# EAGLE schematic CAT Box (EAGLE 9.6.2)
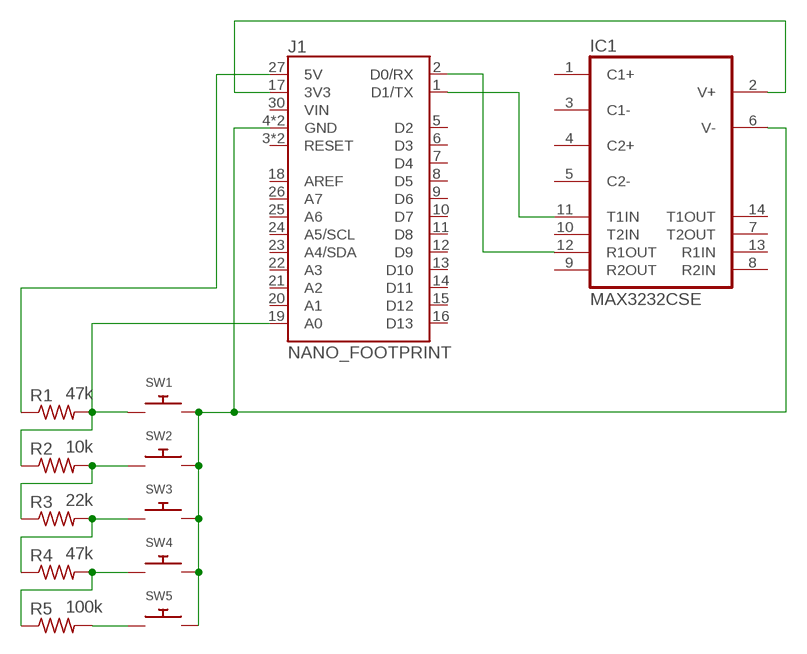
[diagram p0: schematic, sheet 1]

## Parts
IC1  MAX3232CSE  [SO16]
J1  NANO_FOOTPRINT  [NANO]
R1  47k  R-US_0207/10  [0207/10]
R2  10k  R-US_0207/10  [0207/10]
R3  22k  R-US_0207/10  [0207/10]
R4  47k  R-US_0207/10  [0207/10]
R5  100k  R-US_0207/10  [0207/10]
SW1  SWITCH_PUSHBUTTONEVQ-PE  [TACT_PANA-EVQ]
SW2  SWITCH_PUSHBUTTONEVQ-PE  [TACT_PANA-EVQ]
SW3  SWITCH_PUSHBUTTONEVQ-PE  [TACT_PANA-EVQ]
SW4  SWITCH_PUSHBUTTONEVQ-PE  [TACT_PANA-EVQ]
SW5  SWITCH_PUSHBUTTONEVQ-PE  [TACT_PANA-EVQ]

## Nets
N$1: J1.19(A0) R1.2 R2.1 SW1.P$1
N$2: IC1.12(R1OUT) J1.2(D0/RX)
N$3: R2.2 R3.1 SW2.P$1
N$4: R3.2 R4.1 SW3.P$1
N$5: R4.2 R5.1 SW4.P$1
N$6: R5.2 SW5.P$1
N$7: J1.27(5V) R1.1
N$8: IC1.11(T1IN) J1.1(D1/TX)
N$9: IC1.2(V+) J1.17(3V3)
N$10: IC1.6(V-) J1.4(GND) J1.29(GND) SW1.P$2 SW2.P$2 SW3.P$2 SW4.P$2 SW5.P$2
Unconnected: IC1.1(C1+) IC1.3(C1-) IC1.4(C2+) IC1.5(C2-) IC1.7(T2OUT) IC1.8(R2IN) IC1.9(R2OUT) IC1.10(T2IN) IC1.13(R1IN) IC1.14(T1OUT) J1.3(RESET) J1.5(D2) J1.6(D3) J1.7(D4) J1.8(D5) J1.9(D6) J1.10(D7) J1.11(D8) J1.12(D9) J1.13(D10) J1.14(D11) J1.15(D12) J1.16(D13) J1.18(AREF) J1.20(A1) J1.21(A2) J1.22(A3) J1.23(A4/SDA) J1.24(A5/SCL) J1.25(A6) J1.26(A7) J1.28(RESET) J1.30(VIN)

## Power pins joined to a net without a drawn wire
GND: IC1.15(GND)
VCC: IC1.16(VCC)

## Library data of the parts
IC1 = maxim:MAX3232*: True RS-232 Transceivers 3.0V to 5.5V, Low-Power up to 1Mbps, Using Four 0.1µF External Capacitors Source: http://pdfserv.maxim-ic.com/en/ds/MAX3222-MAX3241.pdf; MPN: MAX3232CSE; OC_FARNELL: 9725490; OC_NEWARK: 90C2890
J1 = SparkFun-Boards:NANO_FOOTPRINT: Generic Nano Footprint
R1-R5 = adafruit:R-US_: RESISTOR, American symbol
SW1-SW5 = adafruit:SWITCH_PUSHBUTTON: Buttons SOFTTOUCHSMD_SJ - Soft touch temporary push button (Super Junk Akihabara) Compatible with SKPMANE010 [Mouser: 688-SKPMAN] C&K_KSS = Digikey: KSS221GLFS